# Altium schematic sheet 12VDC_5VDC_XL4015.SchDoc
size A; SheetNumber: 2; SheetTotal: 5
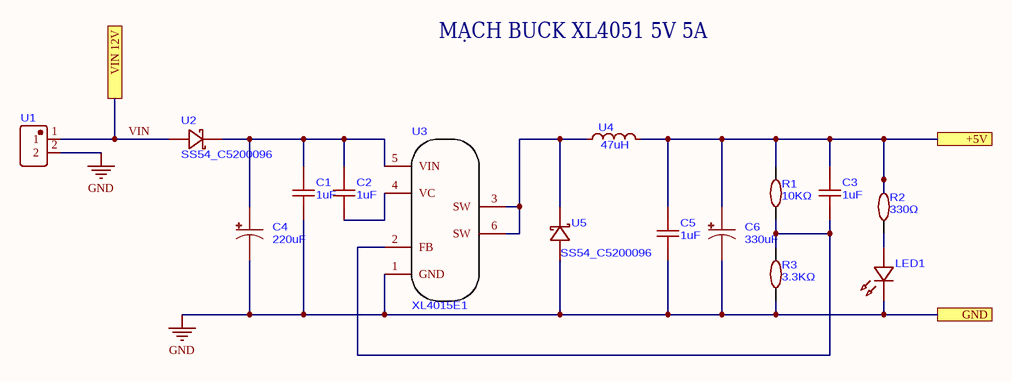
[diagram p0: 12VDC_5VDC_XL4015.SchDoc]

## Parts
C1  1uF  [C0805]
C2  1uF  [C0805]
C3  1uF  [C0805]
C4  220uF  [CAP-SMD_BD10.0-L10.3-W10.3-LS11.0-R-RD]
C5  1uF  [C0805]
C6  330uF  [CAP-SMD_BD10.0-L10.3-W10.3-LS11.0-R-RD]
LED1  XL-2012SURC  [LED0805-RD_RED]  (value not drawn)
R1  10KΩ  [R0805]
R2  330Ω  [R0805]
R3  3.3KΩ  [R0805]
U1  WJ500V-5.08-2P-13-00A  [CONN-TH_2P-P5.08-WJ500V-5.08-2P]  (value not drawn)
U2  SS54_C5200096  [SMB_L4.3-W3.6-LS5.4-RD]
U3  XL4015E1  [TO-263-5_L10.2-W8.9-P1.70-TL]
U4  47uH  [IND-TH_L14.0-W6.5-P8.00-D0.6]
U5  SS54_C5200096  [SMB_L4.3-W3.6-LS5.4-RD]

## Ports
+5V (see Merg_project[2A], ATmega32P[1A], ESP32[1B]), GND (see Merg_project[2A], 12VDC_3V3DC_LM2596[5C], ATmega32P[1A], ESP32[1A]), VIN 12V (see Merg_project[2A], 12VDC_3V3DC_LM2596[2B], ATmega32P[6D])

## Nets
GND: C1.1 C4.2 C5.1 C6.2 LED1.1(K) R3.1 U1.2 U3.1(GND) U5.2 ; port GND
+5V: C3.2 C5.2 C6.1 R1.2 R2.2 U4.2 ; port +5V
VIN: U1.1 U2.2 ; port VIN 12V
NetC1_2: C1.2 C2.2 C4.1 U2.1 U3.5(VIN)
NetC2_1: C2.1 U3.4(VC)
NetC3_1: C3.1 R1.1 R3.2 U3.2(FB)
NetLED1_2: LED1.2(A) R2.1
NetU3_3: U3.3(SW) U3.6(SW) U4.1 U5.1

## Notes on the sheet
- MẠCH BUCK XL4051 5V 5A

## Library data of the parts
C1-C3 C5 = CC0805KRX7R9BB104
C4 C6 = VEJ102M1ATR-1010
R1-R3 = RC0805FR-071KL
U4 = XR050125T680M-V